# Altium schematic sheet 1_reference.SchDoc: Reference
size A3; CompanyName: Altium; Organization: Altium Training Team; Address1: Canada/Germany; Address2: UK / USA and Partner; Address3: Adv Training; Address4: (c) Altium; SheetNumber: 1; SheetTotal: 9
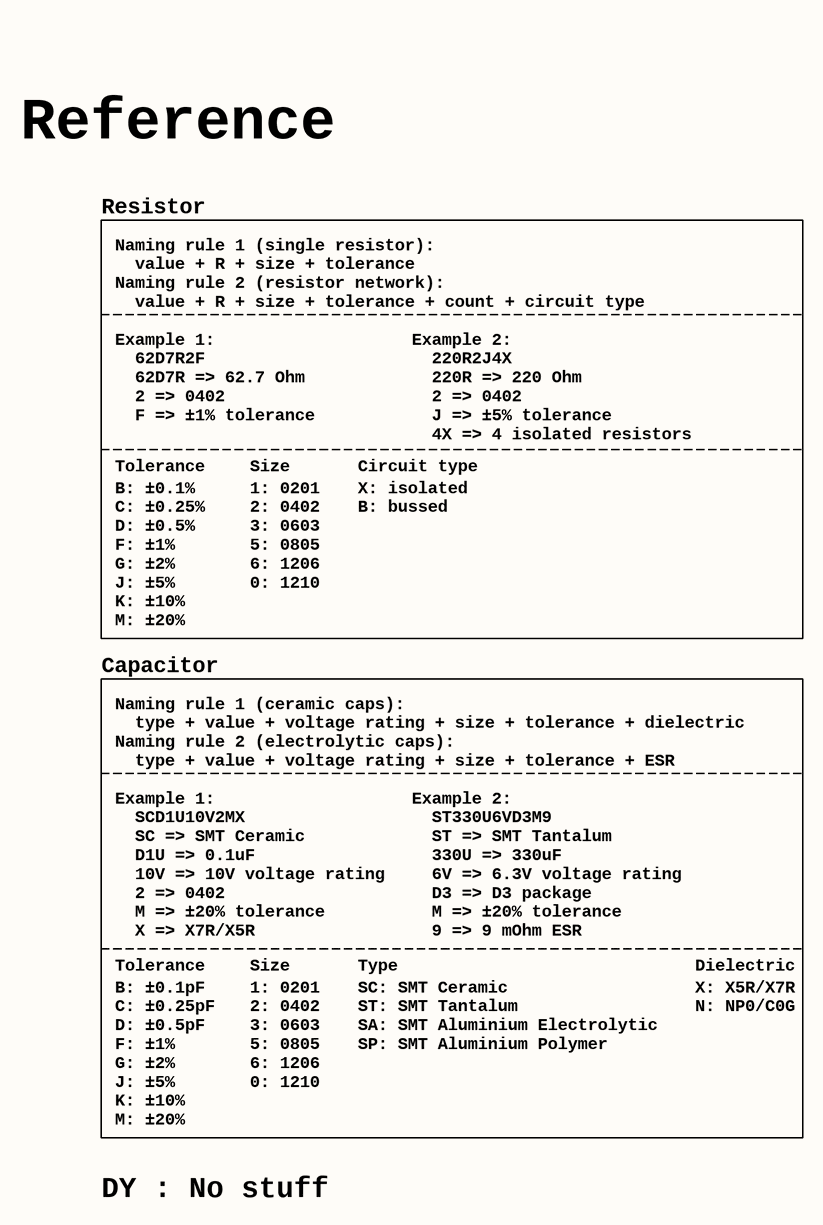
[diagram p0: 1_reference.SchDoc]

## Notes on the sheet
- Reference
- Resistor
- Naming rule 1 (single resistor):
  value + R + size + tolerance
  Naming rule 2 (resistor network):
  value + R + size + tolerance + count + circuit type
- Example 1:
  62D7R2F
  62D7R => 62.7 Ohm
  2 => 0402
  F => ±1% tolerance
- Tolerance
- Size
- Circuit type
- Example 2:
  220R2J4X
  220R => 220 Ohm
  2 => 0402
  J => ±5% tolerance
  4X => 4 isolated resistors
- B: ±0.1%
  C: ±0.25%
  D: ±0.5%
  F: ±1%
  G: ±2%
  J: ±5%
  K: ±10%
  M: ±20%
- 1: 0201
  2: 0402
  3: 0603
  5: 0805
  6: 1206
  0: 1210
- X: isolated
  B: bussed
- Capacitor
- Naming rule 1 (ceramic caps):
  type + value + voltage rating + size + tolerance + dielectric
  Naming rule 2 (electrolytic caps):
  type + value + voltage rating + size + tolerance + ESR
- Example 1:
  SCD1U10V2MX
  SC => SMT Ceramic
  D1U => 0.1uF
  10V => 10V voltage rating
  2 => 0402
  M => ±20% tolerance
  X => X7R/X5R
- Example 2:
  ST330U6VD3M9
  ST => SMT Tantalum
  330U => 330uF
  6V => 6.3V voltage rating
  D3 => D3 package
  M => ±20% tolerance
  9 => 9 mOhm ESR
- Type
- Dielectric
- B: ±0.1pF
  C: ±0.25pF
  D: ±0.5pF
  F: ±1%
  G: ±2%
  J: ±5%
  K: ±10%
  M: ±20%
- SC: SMT Ceramic
  ST: SMT Tantalum
  SA: SMT Aluminium Electrolytic
  SP: SMT Aluminium Polymer
- X: X5R/X7R
  N: NP0/C0G
- DY : No stuff
- Title
- Size:
- Date:
- A3
- Number:
- Time:
- Revision:
- Sheet
- of
- File: